# Altium schematic sheet Sheet1.SchDoc
size A; SheetNumber: 1; SheetTotal: 1
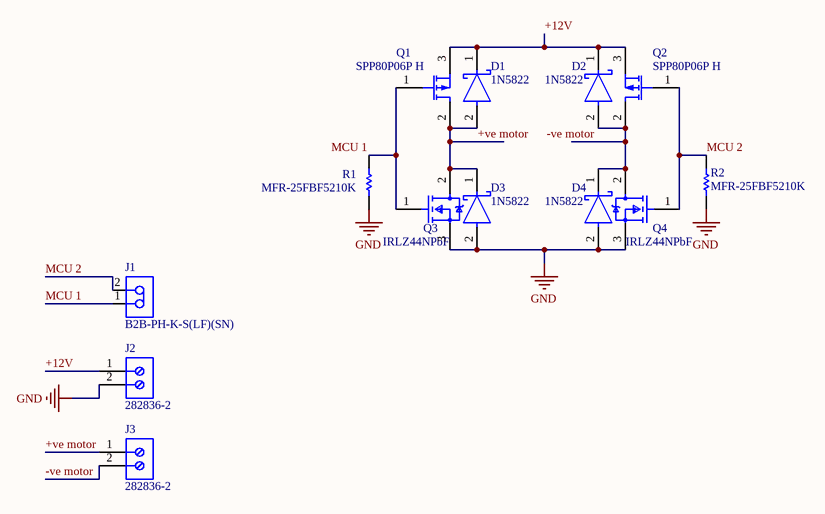
[diagram p0: Sheet1.SchDoc]

## Parts
D1  1N5822  [FP-DO-201AD-MFG]
D2  1N5822  [FP-DO-201AD-MFG]
D3  1N5822  [FP-DO-201AD-MFG]
D4  1N5822  [FP-DO-201AD-MFG]
J1  B2B-PH-K-S(LF)(SN)  [JST-B2B-PH-K-S_V]
J2  282836-2  [TECO-282836-2_V]
J3  282836-2  [TECO-282836-2_V]
Q1  SPP80P06P H  [INF-PG-TO220-3-1_A_V]
Q2  SPP80P06P H  [INF-PG-TO220-3-1_A_V]
Q3  IRLZ44NPbF  [FP-PG-TO220-3-MFG]
Q4  IRLZ44NPbF  [FP-PG-TO220-3-MFG]
R1  MFR-25FBF5210K  [RESA60-630X240]
R2  MFR-25FBF5210K  [RESA60-630X240]

## Nets
GND: D3.2(A) D4.2(A) J2.2 Q3.3(S) Q4.3(S) R1.1 R2.1
+12V: D1.1(C) D2.1(C) J2.1 Q1.3(S) Q2.3(S)
+ve motor: D1.2(A) D3.1(C) J3.1 Q1.2(D) Q3.2(D)
-ve motor: D2.2(A) D4.1(C) J3.2 Q2.2(D) Q4.2(D)
MCU 1: J1.1 Q1.1(G) Q3.1(G) R1.2
MCU 2: J1.2 Q2.1(G) Q4.1(G) R2.2

## Library data of the parts
D1-D4 = CMP-12187-000025-1: DIODE SCHOTTKY 40V 3A DO201AD; Manufacturer: STMicroelectronics; Max Junction Temp: +150°C; Peak Reverse Current: 2mA; Max Surge Forward Current: 80A; Temperature Range High: +150°C; Automotive: No; RoHS: TRUE; ComponentLink2Description: Datasheet; Manufacturer Part Number: 1N5822; Lead Free: Yes; Octopart: https://octopart.com/1n5822-stmicroelectronics-323225; Device Class L2: Diodes; Max Repetitive Reverse Voltage: 40V; Temperature: to +150°C; Height: 5.3mm; Category: Diode; Digikey Description: DIODE SCHOTTKY 40V 3A DO201AD; ComponentLink2URL: https://www.st.com/resource/en/datasheet/1n5822.pdf; Device Class L3: Schottky Diodes; Device Class L1: Discrete Semiconductors; Forward Current: 3A; Mouser Description: Schottky Diodes & Rectifiers Vr/40V Io/3A BULK; Package: DO-201AD
J1 = CMP-2000-05162-1: Male Header, Pitch 2 mm, 1 x 2 Position, Height 6 mm, Tail Length 3.4 mm, -25 to 85 degC, RoHS, Bulk; Manufacturer: JST; Pitch: 2mm; Style/Orientation: StraightHeader/Plug; No of Positions: 2; Datasheet Version: Nov-08; Datasheet URL: http://datasheet.octopart.com/B2B-PH-K-S%28LF%29%28SN%29-JST-datasheet-8324864.pdf; Manufacturer URL: http://www.jst.com/home2.html; Type: ShroudedHeader; Termination: Crimp
J2 J3 = CMP-1684-00017-1: Female Header, Pitch 5 mm, 1 x 2 Position, Height 10 mm, Tail Length 3.5 mm, Rohs, Bulk; Manufacturer: TE Connectivity; Wire Gauge: 16-30AWG; Product Training Modules: Wire-to-BoardEurostyleTerminalBlocks; Clamp Material - Plating: Brass-NickelPlated; Voltage: 300V; Mating Orientation: HorizontalwithBoard; Current: 13.5A; Pitch: 0.197"(5.00mm); Screw Thread: M3; 3D Model: 282836-2.pdf; Other Names: 5ULV-02B / A98076; Dynamic Catalog: BuchananSeries; Number of Levels: 1; Torque - Screw: 0.68Nm(6Lb-In); Featured Product: EurostyleTerminalBlockConnectors; Positions Per Level: 2; Wire Termination: Screw-RisingCageClamp; Datasheet URL: http://www.te.com.cn/commerce/DocumentDelivery/DDEController?Action=showdoc&DocId=Catalog+Section%7F1308389_EUROSTYLE_TERMINAL_BLOCKS%7F0607%7Fpdf%7FEnglish%7FENG_CS_1308389_EUROSTYLE_TERMINAL_BLOCKS_0607.pdf%7F282836-2; Color: Green; Family: TerminalBlocks-WiretoBoard; RoHS Information: 282836-2StatementofCompliance; Standard Package: 300; Contact Material - Plating: Brass-TinPlated; Manufacturer URL: http://www.te.com; Housing Material: Polyamide(PA66),Nylon6/6; Features: Interlocking(Side); Package Description: Female Header, Pitch 5 mm, 1 x 2 Position, Height 10 mm, Tail Length 3.5 mm; Mounting Type: ThroughHole; Package Reference: THD; Packaging: Bulk; Series: Buchanan; Category: Connectors,Interconnects; Screw Material - Plating: Brass-NickelPlated
Q1 Q2 = CMP-1099-00045-1: P-Channel SIPMOS Power-Transistor, -60 V VDS, -80 A ID, -55 to 175 degC, PG-TO220-3-1, Tube, Green; Manufacturer: Infineon; Pto t (max): 340Â W; VDS (max): -60Â V; IDpuls (max): -320Â A; Green: TRUE; RDS (on) (max): 23Â mOhm; VGS(th) (max): -4Â V; Rth: 0.4Â K/W; ID (max): -80Â A; QG: 115Â nC; VGS(th) (min): -2.1Â V; ComponentLink1URL: http://www.infineon.com/; DatasheetVersion: Rev. 1.5; ComponentLink2URL: http://www.infineon.com/dgdl/SPP80P06P+H_Rev1.5.pdf?folderId=db3a3043156fd5730115d6a107c41454&fileId=db3a304325afd6e001264bbdf4a70ca7; ComponentLink1Description: Manufacturer URL; ComponentLink3Description: Package Specification; Halogen-free: TRUE; PackageReference: PG-TO220-3-1; PackageVersion: Rev. 05, 08/2007; ComponentLink3URL: http://www.infineon.com/dgdl/IPP028N08N3_Rev1%5B1%5D.0.pdf?folderId=db3a304313b8b5a60113cee8763b02d7&fileId=db3a30432313ff5e0123a3c08e7326b5; Packing: Tube; Mounting Technology: Through Hole; PackageDescription: 3-Pin Plastic (Green) Transistor Single Outline Package, 10.03 x 8.98 mm Body, 2.54 mm Pitch; RthJC (max): 0.4Â K/W; ComponentLink2Description: Datasheet; PartNumber: SPP80P06P H
Q3 Q4 = CMP-32901-000488-1: MOSFET N-CH 55V 47A TO220AB; Turn-On Delay Time: 11ns; Gate to Source Voltage (Vgs): 16V; Element Configuration: Single; Rds On Max: 22mR; Turn-Off Delay Time: 26ns; Max Power Dissipation: 110W; Threshold Voltage: 2V; Drain to Source Resistance: 35mR; Input Capacitance: 1.7nF; Continuous Drain Current (ID): 47A; Case/Package: TO-220; Lead Free: Lead Free; Halogen Free: Halogen Free; Packaging: Rail/Tube; Length: 0.414inch; Min Operating Temperature: -55°C; REACH SVHC: No SVHC; Number of Pins: 3; Width: 0.185inch; Drain to Source Voltage (Vdss): 55V; Power Dissipation: 110W; RoHS Compliant: Yes; Max Operating Temperature: 175°C; Height: 0.6inch; Max Dual Supply Voltage: 55V; Drain to Source Breakdown Voltage: 55V; Mount: Through Hole
R1 R2 = CMP-1659-00074-2: Axial Resistor, 10 KOhm, +/- 1%, 0.25 W, -55 to 155 degC, 2-Pin THD, RoHS, Bulk; Manufacturer: Yageo; Temperature Coefficient: 100ppm\/degreesC; Voltage Rating: 250V; Voltage Rating (DC): 200V; Resistance: 10KOhm; Max Power Dissipation: 250mW; Datasheet URL: http://www.yageo.com/documents/recent/Yageo%20LR_MFR_2013.pdf; Packaging: Bulk; RoHSCompliant: True; Mount: ThroughHole; Package Reference: MFR-25; Termination: Axial; Composition: MetalFilm; Number of Terminations: 2; Package Quantity: 200; Mounting Technology: ThroughHole; Length: 0.248inch; Max Operating Temperature: 155degC; Min Operating Temperature: -55degC; Datasheet Version: 04/2013; Lead Free: LeadFree; Manufacturer URL: http://www.yageo.com/; Tolerance: 1%; Power Rating: 250mW; Package Description: 2-Pin Axial Lead, Dia 2.4 mm, Body Length 6.3 mm; Military Standard: Not; Case\/Package: Axial